# Altium schematic sheet STM32_MPU_IOs.SchDoc: MPU
size A3; SheetNumber: 3; SheetTotal: 7
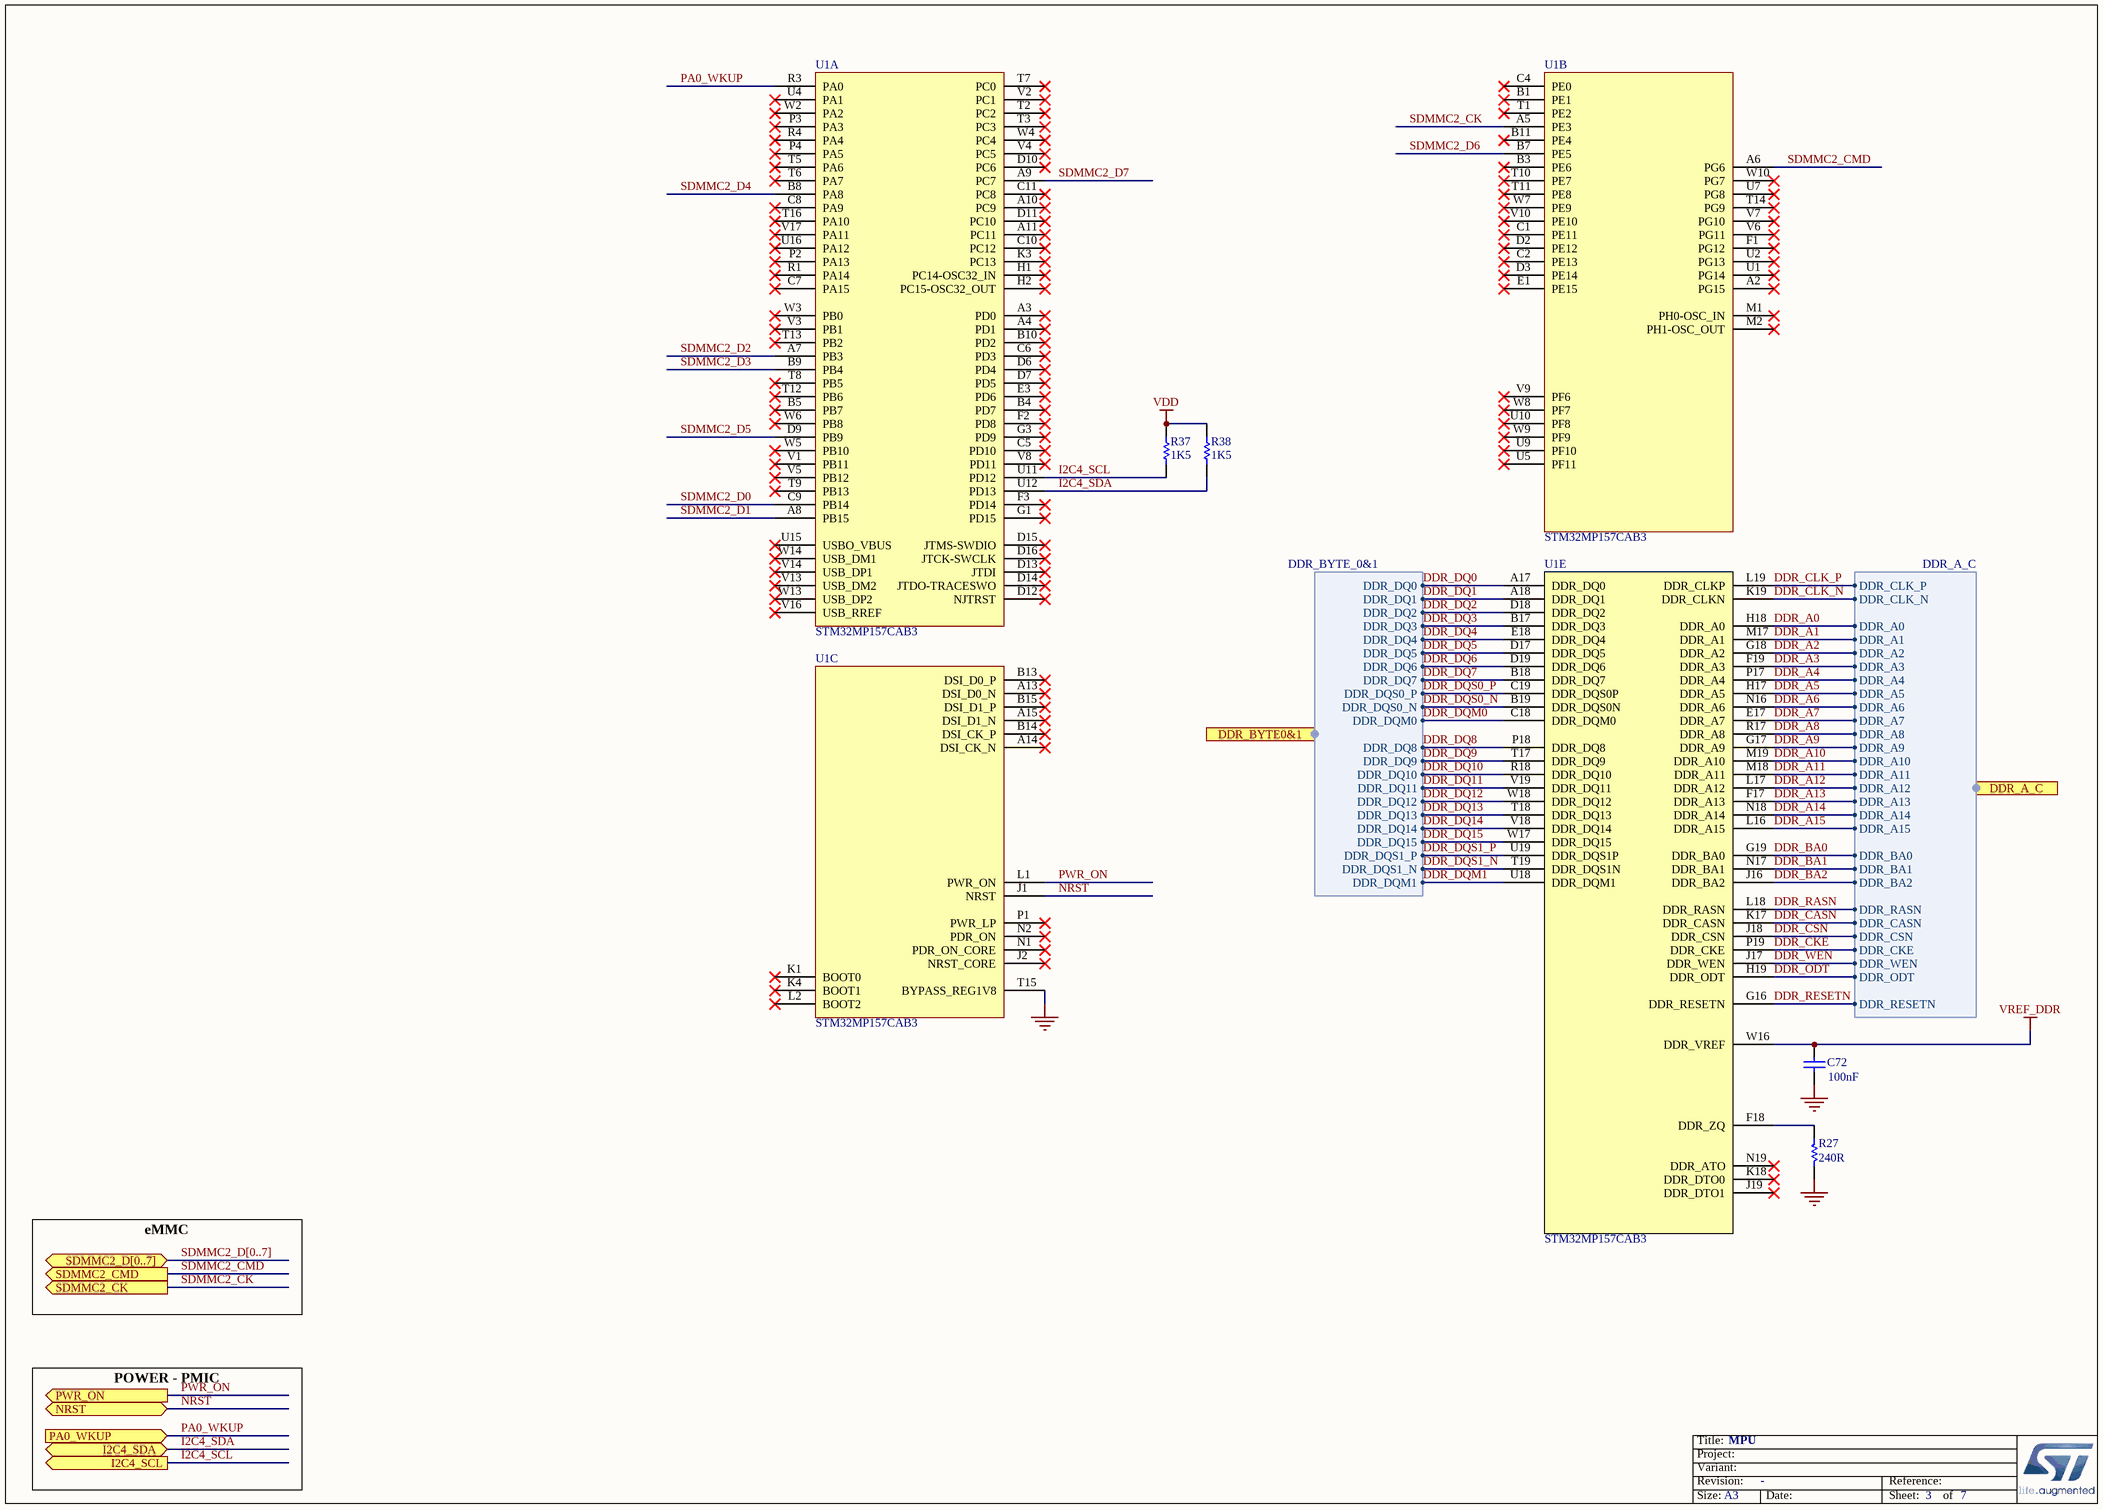
[diagram p0: STM32_MPU_IOs.SchDoc]

## Parts
C72  value 100nF  [C0402]
R27  value 240R  [R0402]
R37  value 1K5  [R0402]
R38  value 1K5  [R0402]
U1  STM32MP157CAB3  [ICC_LFBGA354_16X16_STM32MP157CAB3_P080]  (parts A,B,C,E of 5)

## Ports
DDR_A_C (harness DDR_A_C), DDR_BYTE0&1 (harness DDR_BYTE_0&1), I2C4_SCL (out), I2C4_SDA (bidir), NRST (bidir), PA0_WKUP (in), PWR_ON (out), SDMMC2_CK (out), SDMMC2_CMD (out), SDMMC2_D[0..7] (bidir)

## Harnesses
DDR_BYTE_0&1: DDR_DQ0, DDR_DQ1, DDR_DQ2, DDR_DQ3, DDR_DQ4, DDR_DQ5, DDR_DQ6, DDR_DQ7, DDR_DQS0_P, DDR_DQS0_N, DDR_DQM0, DDR_DQ8, DDR_DQ9, DDR_DQ10, DDR_DQ11, DDR_DQ12, DDR_DQ13, DDR_DQ14, DDR_DQ15, DDR_DQS1_P, DDR_DQS1_N, DDR_DQM1
DDR_A_C: DDR_CLK_P, DDR_CLK_N, DDR_A0, DDR_A1, DDR_A2, DDR_A3, DDR_A4, DDR_A5, DDR_A6, DDR_A7, DDR_A8, DDR_A9, DDR_A10, DDR_A11, DDR_A12, DDR_A13, DDR_A14, DDR_BA0, DDR_BA1, DDR_BA2, DDR_RASN, DDR_CASN, DDR_CSN, DDR_CKE, DDR_WEN, DDR_ODT, DDR_RESETN, DDR_A15

## Nets
GND: C72.1 R27.2 U1.T15(BYPASS_REG1V8)
VDD: R37.1 R38.1
VREF_DDR: C72.2 U1.W16(DDR_VREF)
DDR_A0: U1.H18(DDR_A0) ; port DDR_A_C.DDR_A0
DDR_A1: U1.M17(DDR_A1) ; port DDR_A_C.DDR_A1
DDR_A2: U1.G18(DDR_A2) ; port DDR_A_C.DDR_A2
DDR_A3: U1.F19(DDR_A3) ; port DDR_A_C.DDR_A3
DDR_A4: U1.P17(DDR_A4) ; port DDR_A_C.DDR_A4
DDR_A5: U1.H17(DDR_A5) ; port DDR_A_C.DDR_A5
DDR_A6: U1.N16(DDR_A6) ; port DDR_A_C.DDR_A6
DDR_A7: U1.E17(DDR_A7) ; port DDR_A_C.DDR_A7
DDR_A8: U1.R17(DDR_A8) ; port DDR_A_C.DDR_A8
DDR_A9: U1.G17(DDR_A9) ; port DDR_A_C.DDR_A9
DDR_A10: U1.M19(DDR_A10) ; port DDR_A_C.DDR_A10
DDR_A11: U1.M18(DDR_A11) ; port DDR_A_C.DDR_A11
DDR_A12: U1.L17(DDR_A12) ; port DDR_A_C.DDR_A12
DDR_A13: U1.F17(DDR_A13) ; port DDR_A_C.DDR_A13
DDR_A14: U1.N18(DDR_A14) ; port DDR_A_C.DDR_A14
DDR_A15: U1.L16(DDR_A15) ; port DDR_A_C.DDR_A15
DDR_BA0: U1.G19(DDR_BA0) ; port DDR_A_C.DDR_BA0
DDR_BA1: U1.N17(DDR_BA1) ; port DDR_A_C.DDR_BA1
DDR_BA2: U1.J16(DDR_BA2) ; port DDR_A_C.DDR_BA2
DDR_CASN: U1.K17(DDR_CASN) ; port DDR_A_C.DDR_CASN
DDR_CKE: U1.P19(DDR_CKE) ; port DDR_A_C.DDR_CKE
DDR_CLK_N: U1.K19(DDR_CLKN) ; port DDR_A_C.DDR_CLK_N
DDR_CLK_P: U1.L19(DDR_CLKP) ; port DDR_A_C.DDR_CLK_P
DDR_CSN: U1.J18(DDR_CSN) ; port DDR_A_C.DDR_CSN
DDR_DQ0: U1.A17(DDR_DQ0) ; port DDR_BYTE0&1.DDR_DQ0
DDR_DQ1: U1.A18(DDR_DQ1) ; port DDR_BYTE0&1.DDR_DQ1
DDR_DQ2: U1.D18(DDR_DQ2) ; port DDR_BYTE0&1.DDR_DQ2
DDR_DQ3: U1.B17(DDR_DQ3) ; port DDR_BYTE0&1.DDR_DQ3
DDR_DQ4: U1.E18(DDR_DQ4) ; port DDR_BYTE0&1.DDR_DQ4
DDR_DQ5: U1.D17(DDR_DQ5) ; port DDR_BYTE0&1.DDR_DQ5
DDR_DQ6: U1.D19(DDR_DQ6) ; port DDR_BYTE0&1.DDR_DQ6
DDR_DQ7: U1.B18(DDR_DQ7) ; port DDR_BYTE0&1.DDR_DQ7
DDR_DQ8: U1.P18(DDR_DQ8) ; port DDR_BYTE0&1.DDR_DQ8
DDR_DQ9: U1.T17(DDR_DQ9) ; port DDR_BYTE0&1.DDR_DQ9
DDR_DQ10: U1.R18(DDR_DQ10) ; port DDR_BYTE0&1.DDR_DQ10
DDR_DQ11: U1.V19(DDR_DQ11) ; port DDR_BYTE0&1.DDR_DQ11
DDR_DQ12: U1.W18(DDR_DQ12) ; port DDR_BYTE0&1.DDR_DQ12
DDR_DQ13: U1.T18(DDR_DQ13) ; port DDR_BYTE0&1.DDR_DQ13
DDR_DQ14: U1.V18(DDR_DQ14) ; port DDR_BYTE0&1.DDR_DQ14
DDR_DQ15: U1.W17(DDR_DQ15) ; port DDR_BYTE0&1.DDR_DQ15
DDR_DQM0: U1.C18(DDR_DQM0) ; port DDR_BYTE0&1.DDR_DQM0
DDR_DQM1: U1.U18(DDR_DQM1) ; port DDR_BYTE0&1.DDR_DQM1
DDR_DQS0_N: U1.B19(DDR_DQS0N) ; port DDR_BYTE0&1.DDR_DQS0_N
DDR_DQS0_P: U1.C19(DDR_DQS0P) ; port DDR_BYTE0&1.DDR_DQS0_P
DDR_DQS1_N: U1.T19(DDR_DQS1N) ; port DDR_BYTE0&1.DDR_DQS1_N
DDR_DQS1_P: U1.U19(DDR_DQS1P) ; port DDR_BYTE0&1.DDR_DQS1_P
DDR_ODT: U1.H19(DDR_ODT) ; port DDR_A_C.DDR_ODT
DDR_RASN: U1.L18(DDR_RASN) ; port DDR_A_C.DDR_RASN
DDR_RESETN: U1.G16(DDR_RESETN) ; port DDR_A_C.DDR_RESETN
DDR_WEN: U1.J17(DDR_WEN) ; port DDR_A_C.DDR_WEN
I2C4_SCL: R37.2 U1.U11(PD12) ; port I2C4_SCL
I2C4_SDA: R38.2 U1.U12(PD13) ; port I2C4_SDA
NRST: U1.J1(NRST) ; port NRST
PA0_WKUP: U1.R3(PA0) ; port PA0_WKUP
PWR_ON: U1.L1(PWR_ON) ; port PWR_ON
SDMMC2_CK: U1.A5(PE3) ; port SDMMC2_CK
SDMMC2_CMD: U1.A6(PG6) ; port SDMMC2_CMD
SDMMC2_D0: U1.C9(PB14)
SDMMC2_D1: U1.A8(PB15)
SDMMC2_D2: U1.A7(PB3)
SDMMC2_D3: U1.B9(PB4)
SDMMC2_D4: U1.B8(PA8)
SDMMC2_D5: U1.D9(PB9)
SDMMC2_D6: U1.B7(PE5)
SDMMC2_D7: U1.A9(PC7)
NetR27_1: R27.1 U1.F18(DDR_ZQ)

Not connected (* = marked no-connect by the designer): U1 A2(PG15)* A3(PD0)* A4(PD1)* A10(PC9)* A11(PC11)* A13(DSI_D0_N)* A14(DSI_CK_N)* A15(DSI_D1_N)* B1(PE1)* B3(PE6)* B4(PD7)* B5(PB7)* B10(PD2)* B11(PE4)* B13(DSI_D0_P)* B14(DSI_CK_P)* B15(DSI_D1_P)* C1(PE11)* C2(PE13)* C4(PE0)* C5(PD10)* C6(PD3)* C7(PA15)* C8(PA9)* C10(PC12)* C11(PC8)* D2(PE12)* D3(PE14)* D6(PD4)* D7(PD5)* D10(PC6)* D11(PC10)* D12(NJTRST)* D13(JTDI)* D14(JTDO-TRACESWO)* D15(JTMS-SWDIO)* D16(JTCK-SWCLK)* E1(PE15)* E3(PD6)* F1(PG12)* F2(PD8)* F3(PD14)* G1(PD15)* G3(PD9)* H1(PC14-OSC32_IN)* H2(PC15-OSC32_OUT)* J2(NRST_CORE)* J19(DDR_DTO1)* K1(BOOT0)* K3(PC13)* K4(BOOT1)* K18(DDR_DTO0)* L2(BOOT2)* M1(PH0-OSC_IN)* M2(PH1-OSC_OUT)* N1(PDR_ON_CORE)* N2(PDR_ON)* N19(DDR_ATO)* P1(PWR_LP)* P2(PA13)* P3(PA3)* P4(PA5)* R1(PA14)* R4(PA4)* T1(PE2)* T2(PC2)* T3(PC3)* T5(PA6)* T6(PA7)* T7(PC0)* T8(PB5)* T9(PB13)* T10(PE7)* T11(PE8)* T12(PB6)* T13(PB2)* T14(PG9)* T16(PA10)* U1(PG14)* U2(PG13)* U4(PA1)* U5(PF11)* U7(PG8)* U9(PF10)* U10(PF8)* U15(USBO_VBUS)* U16(PA12)* V1(PB11)* V2(PC1)* V3(PB1)* V4(PC5)* V5(PB12)* V6(PG11)* V7(PG10)* V8(PD11)* V9(PF6)* V10(PE10)* V13(USB_DM2)* V14(USB_DP1)* V16(USB_RREF)* V17(PA11)* W2(PA2)* W3(PB0)* W4(PC4)* W5(PB10)* W6(PB8)* W7(PE9)* W8(PF7)* W9(PF9)* W10(PG7)* W13(USB_DP2)* W14(USB_DM1)*

## Buses and harness runs
bus SDMMC2_D[0..7] = port SDMMC2_D[0..7]

## Notes on the sheet
- eMMC
- POWER - PMIC
- Title:
- Project:
- Size:
- Revision:
- Variant:
- A3
- -
- Date:
- Reference:
- Sheet:
- of

## Library data of the parts
C72 = MCD-00006: Capacitor, MLCC, 100nF, 16V, X7R, 10%, 0402, T=0.5mm; Manufacturer_Part_Number: CC0402KRX7R7BB104; Manufacturer: YAGEO; Alternate_Manufacturer_Part_Number: GCM155R71C104KA55D; Alternate_Manufacturer: MURATA; Provided_By: SUBCO; ECCN_US: EAR99; ECCN_EU: NEC; Internal_Part_Number: MCD-00006; ComponentLink1Description: Datasheet; Status: Released; Part_Type: Capacitor; Package: C0402; ComponentLink1URL: http://tunmcdsvn.tun.st.com/Component_Datasheet_Library/Trunk/Capacitors/Yageo_Multilayer_Capacitor_X7R_series_100pF_to_22uF
R27 = MCD-00120: Resistor,240R,0402,1%,1/16W; Manufacturer_Part_Number: RC0402FR-07240RL; Manufacturer: YAGEO; Provided_By: SUBCO; ECCN_US: EAR99; ECCN_EU: NEC; Internal_Part_Number: MCD-00120; ComponentLink1Description: Datasheet; Status: Released; Part_Type: Resistor; ComponentLink1URL: http://tunmcdsvn.tun.st.com/Component_Datasheet_Library/Trunk/Resistors/Yageo_Resistor_RC0402-series; Package: R0402
R37 R38 = MCD-00068: Resistor,1K5,0402,1%,1/16W; Manufacturer_Part_Number: RC0402FR-071K5L; Manufacturer: YAGEO; Provided_By: SUBCO; ECCN_US: EAR99; ECCN_EU: NEC; Internal_Part_Number: MCD-00068; ComponentLink1Description: Datasheet; Status: Released; Part_Type: Resistor; ComponentLink1URL: http://tunmcdsvn.tun.st.com/Component_Datasheet_Library/Trunk/Resistors/Yageo_Resistor_RC0402-series; Package: R0402
U1 = MCD-01805: MPU LFBGA 16x16x1.271 PITCH 0.8 mm secure boot + crypto; Part_Type: IC; Manufacturer: STMICROELECTRONICS; ECCN_US: 5A992C; ECCN_EU: 5A002A4; Provided_By: SUBCO with ST control; Company_Nationality: Netherlands; CCATS: G179243   5A992C 740.17(B)(3) 25-Mar-2019; Component_Country_Of_Origin: Korea (South); Internal_Part_Number: MCD-01805; Value: STM32MP157CAB3; Status: Released; Manufacturer_Part_Number: STM32MP157CAB3; Package: LFBGA; ComponentLink1Description: Datasheet; ComponentLink1URL: http://tunmcdsvn.tun.st.com/Component_Datasheet_Library/Trunk/IC/STM_MPU_STM32MP157C/stm32mp157c.pdf; Export_Juridiction: EU; California_Proposition_65: N/A